# EAGLE design edl_transmitter (EAGLE 7.2.0)
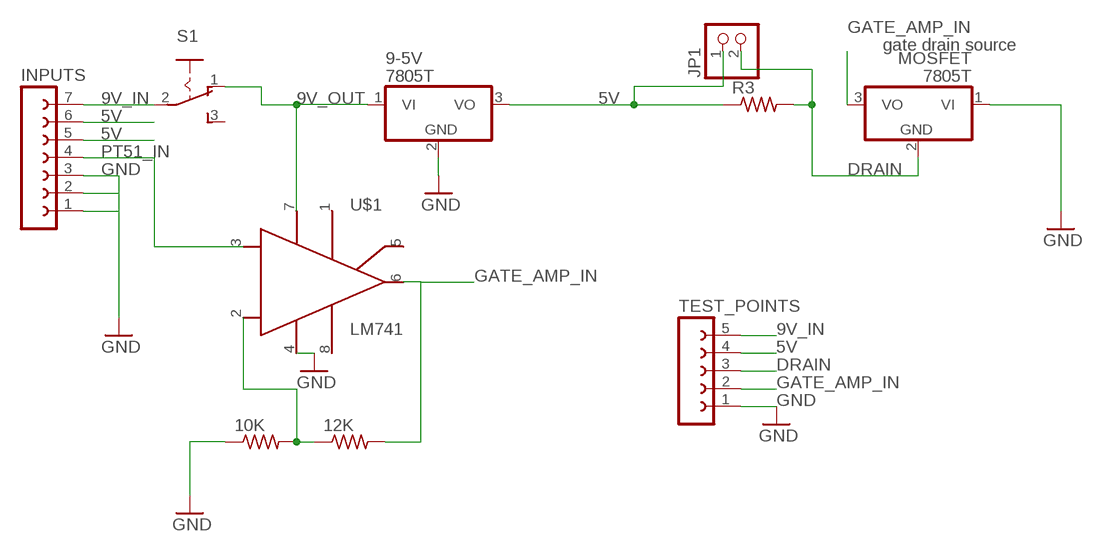
[diagram p0: schematic, sheet 1]

## Parts
9-5V  7805T  [TO220H]
10K  R-US_0207/10  [0207/10]
12K  R-US_0207/10  [0207/10]
INPUTS  FE07-1  [FE07]
JP1  PINHD-1X2  [1X02]
MOSFET  7805T  [TO220H]
R3  R-US_0207/10  [0207/10]
S1  255SB  [255SB]
TEST_POINTS  FE05-1  [FE05-1]
U$1  OPAMP-741-DIP  [OPAMP-741-DIP]

## Nets
5V: 9-5V.3(VO) INPUTS.5 INPUTS.6 JP1.1 R3.1 TEST_POINTS.4
9V_IN: INPUTS.7 S1.2(P) TEST_POINTS.5
9V_OUT: 9-5V.1(VI) S1.1(O) U$1.7
DRAIN: JP1.2 MOSFET.2(GND) R3.2 TEST_POINTS.3
GATE_AMP_IN: 12K.2 MOSFET.3(VO) TEST_POINTS.2 U$1.6
GND: 9-5V.2(GND) 10K.1 INPUTS.1 INPUTS.2 INPUTS.3 MOSFET.1(VI) TEST_POINTS.1 U$1.4
N$5: 10K.2 12K.1 U$1.2
PT51_IN: INPUTS.4 U$1.3
Unconnected: S1.3(S) U$1.1 U$1.5 U$1.8

## Notes on the sheet
- gate drain source

## Library data of the parts
9-5V MOSFET = linear:78*: Positive VOLTAGE REGULATOR Source: http://cache.national.com/ds/LM/LM78L05.pdf http://www.fairchildsemi.com/ds/LM/LM7805.pdf
10K 12K R3 = resistor:R-US_: RESISTOR, American symbol
INPUTS = con-lsta:FE07-1: FEMALE HEADER; OC_FARNELL: unknown; OC_NEWARK: unknown
JP1 = pinhead:PINHD-1X2: PIN HEADER
S1 = switch:255SB: SLIDING SWITCH Distributor Buerklin, 11G810
TEST_POINTS = con-lsta:FE05-1: FEMALE HEADER; OC_FARNELL: unknown; OC_NEWARK: unknown
U$1 = opamp-741-dip:OPAMP-741-DIP

## Board
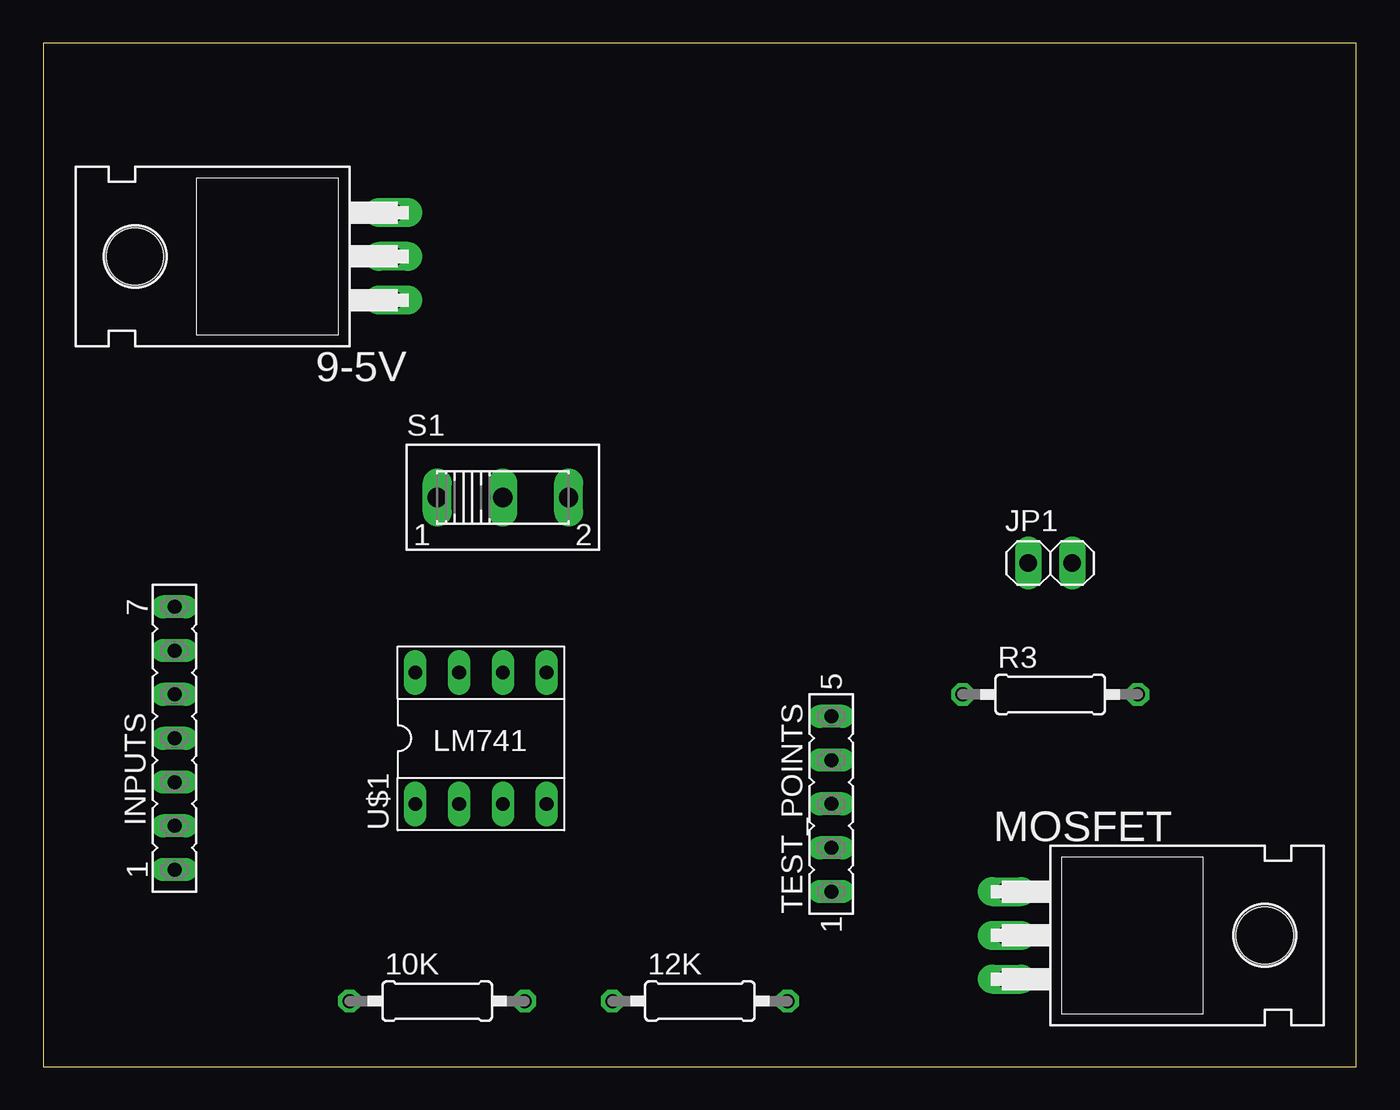
[diagram p1: board, top side]
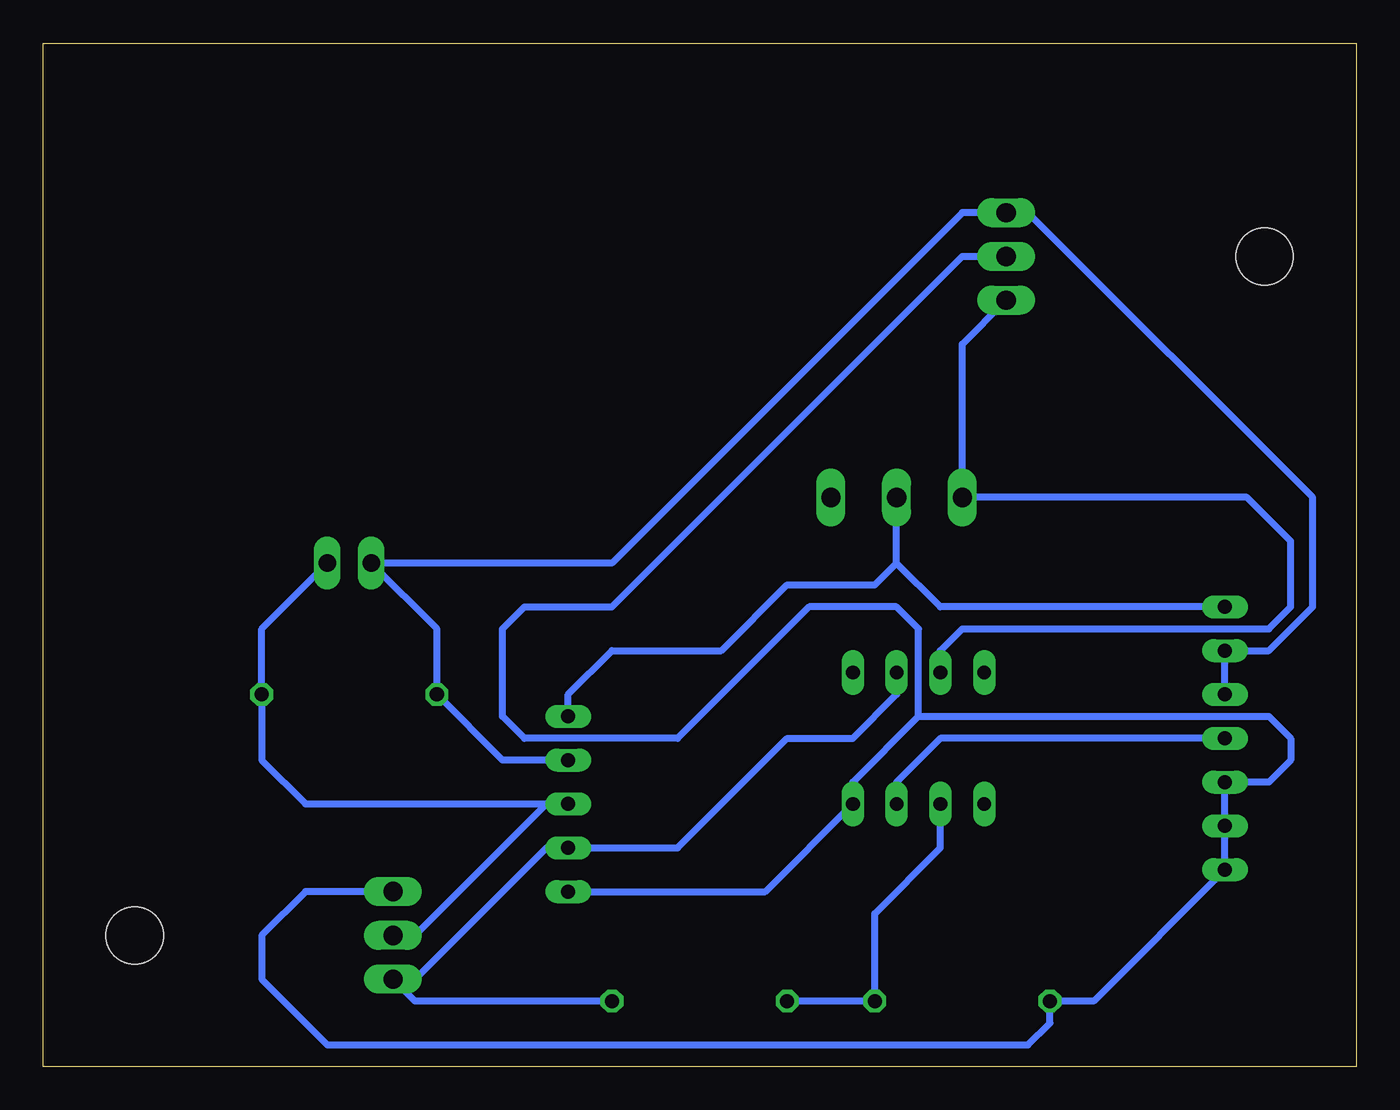
[diagram p2: board, bottom side, seen from below]

Size 76.18 x 59.36 mm. Coordinates in mm from the lower left corner, seen from the top.
Outline: 0,0 76.18,0 76.18,59.36 0,59.36 0,0
Copper layers (1*16): Top 0.035mm / dielectric 1.5mm / Bottom 0.035mm
Design rules "default": minimum track width 10mil, minimum drill 24mil, track to track 8mil, track to pad 8mil, pad to pad 8mil, via to via 8mil, smd to smd 8mil, copper to edge 40mil, drill to drill 8mil, minimum pad ring 10mil, minimum via ring 8mil, stop-mask expansion 4mil, vias tented up to drill 0mil, thermal gap 10mil

### Footprints (pad centres in the part's own frame; a part is rotated, then mirrored left to right if it is on the bottom)
TO220H = drill 1.118 long: 1 -2.54,-10.16; 2 0,-10.16; 3 2.54,-10.16 | hole 3.302: 0,4.826
0207/10 = drill 0.813 octagon: 1 -5.08,0; 2 5.08,0
FE07 = drill 0.813 long: 1 -7.62,0; 2 -5.08,0; 3 -2.54,0; 4 0,0; 5 2.54,0; 6 5.08,0; 7 7.62,0
1X02 = drill 1.016 long: 1 -1.27,0; 2 1.27,0
255SB = drill 1.118 long: 1 -3.81,0; 2 0,0; 3 3.81,0
FE05-1 = drill 0.813 long: 1 -5.08,0; 2 -2.54,0; 3 0,0; 4 2.54,0; 5 5.08,0
OPAMP-741-DIP = drill 0.8 long: 1 0,0; 2 2.54,0; 3 5.08,0; 4 7.62,0; 5 7.62,7.62; 6 5.08,7.62; 7 2.54,7.62; 8 0,7.62

### Placement (x,y rotation side)
9-5V  10.16,46.99 90 top
10K  22.86,3.81 0 top
12K  38.1,3.81 0 top
INPUTS  7.62,19.05 90 top
JP1  58.42,29.21 0 top
MOSFET  66.04,7.62 270 top
R3  58.42,21.59 0 top
S1  26.67,33.02 0 top
TEST_POINTS  45.72,15.24 90 top
U$1  21.59,15.24 0 top

### Tracks (layer width: path | path; a pad name or v marks a point on that pad's centre or on a via)
5V
  Bottom 0.406: INPUTS.5 INPUTS.6 5.08,24.13 2.54,26.67 2.54,33.02 19.05,49.53 9-5V.3 22.86,49.53 43.18,29.21 JP1.1 53.34,25.4 R3.1 49.53,17.78 TEST_POINTS.4
9V_IN
  Bottom 0.406: 26.67,29.21 S1.2 | INPUTS.7 24.13,26.67 26.67,29.21 | TEST_POINTS.5 45.72,21.59 43.18,24.13 36.83,24.13 33.02,27.94 27.94,27.94 26.67,29.21
9V_OUT
  Bottom 0.406: 9-5V.1 22.86,41.91 S1.1 6.35,33.02 3.81,30.48 3.81,26.67 5.08,25.4 22.86,25.4 24.13,24.13 U$1.7
DRAIN
  Bottom 0.406: JP1.2 63.5,25.4 R3.2 63.5,17.78 60.96,15.24 TEST_POINTS.3 46.99,15.24 54.61,7.62 MOSFET.2
GATE_AMP_IN
  Bottom 0.406: 12K.2 54.61,3.81 MOSFET.3 54.61,5.08 46.99,12.7 TEST_POINTS.2 39.37,12.7 33.02,19.05 29.21,19.05 26.67,21.59 U$1.6
GND
  Bottom 0.406: MOSFET.1 60.96,10.16 63.5,7.62 63.5,5.08 59.69,1.27 19.05,1.27 17.78,2.54 10K.1 15.24,3.81 INPUTS.1 INPUTS.2 INPUTS.3 5.08,16.51 3.81,17.78 3.81,19.05 5.08,20.32 25.4,20.32 | 25.4,20.32 29.21,16.51 U$1.4 34.29,10.16 TEST_POINTS.1 | 25.4,20.32 25.4,25.4 26.67,26.67 31.75,26.67 39.37,19.05 48.26,19.05 49.53,20.32 49.53,25.4 48.26,26.67 43.18,26.67 22.86,46.99 9-5V.2
N$5
  Bottom 0.406: 12K.1 10K.2 27.94,8.89 24.13,12.7 U$1.2
PT51_IN
  Bottom 0.406: INPUTS.4 24.13,19.05 26.67,16.51 U$1.3